# EAGLE design 8x8x8_LEDCUBE_Electronics (EAGLE 9.5.1)
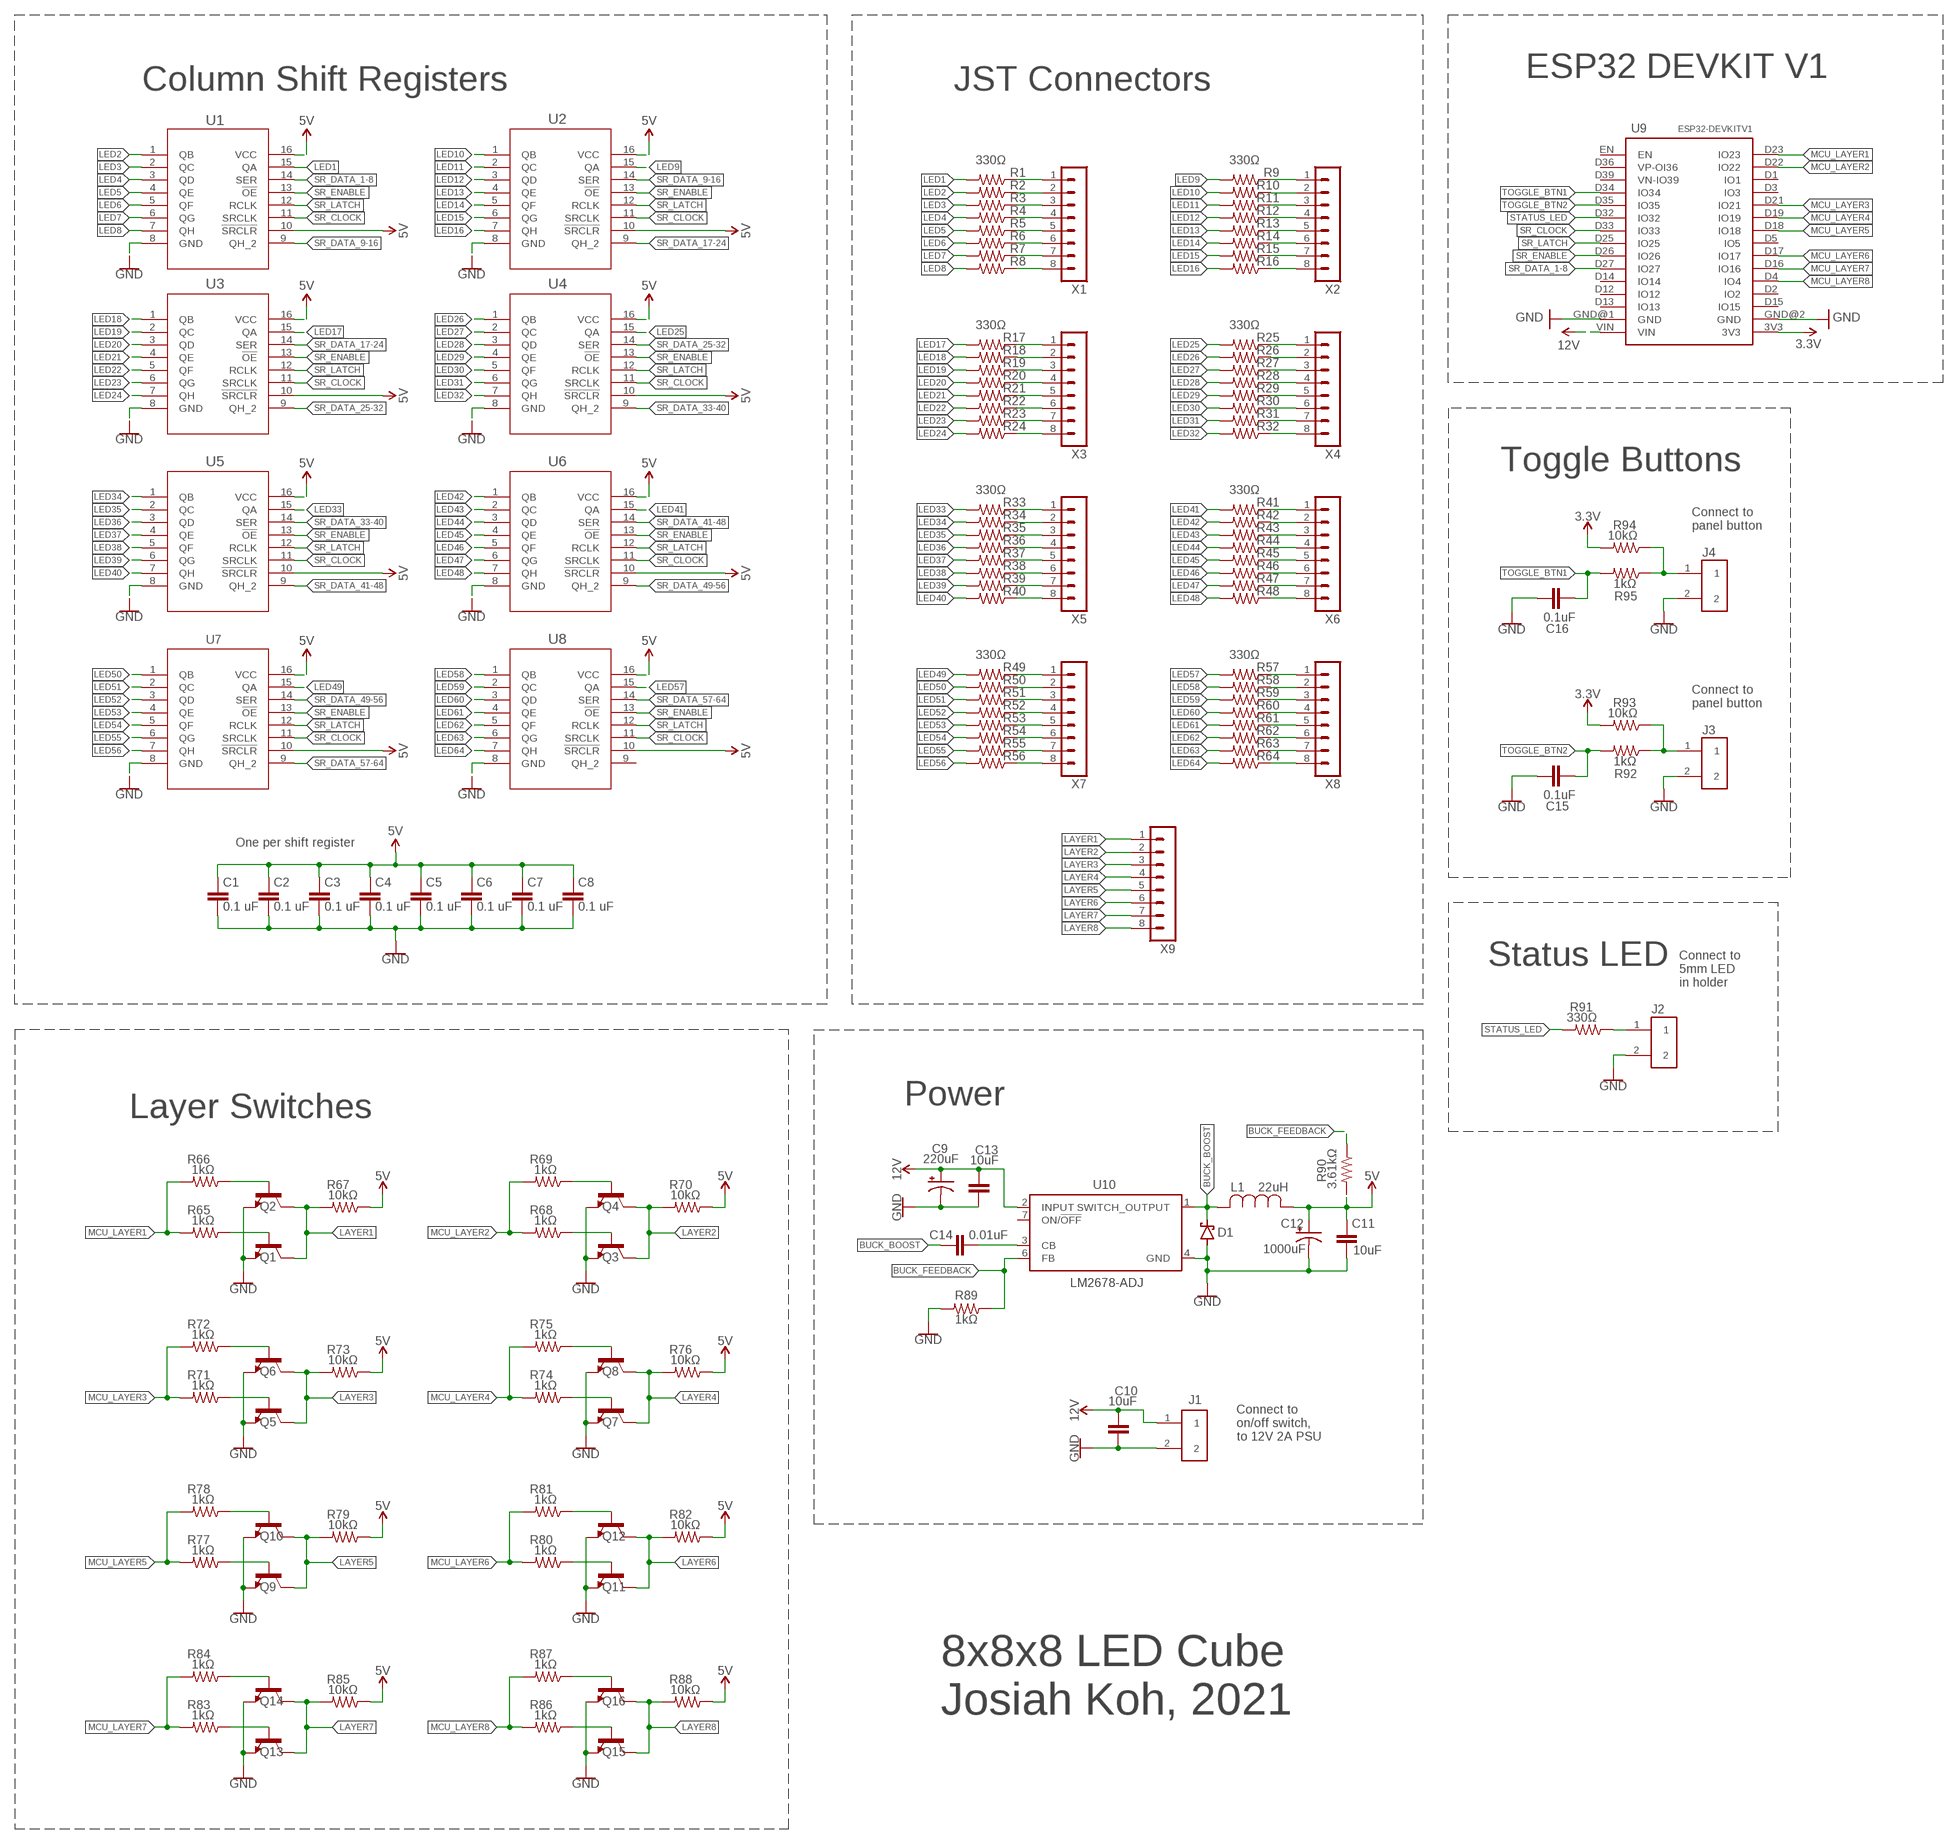
[diagram p0: schematic, sheet 1]

## Parts
C1  0.1 uF  C-EUC0805  [C0805]
C2  0.1 uF  C-EUC0805  [C0805]
C3  0.1 uF  C-EUC0805  [C0805]
C4  0.1 uF  C-EUC0805  [C0805]
C5  0.1 uF  C-EUC0805  [C0805]
C6  0.1 uF  C-EUC0805  [C0805]
C7  0.1 uF  C-EUC0805  [C0805]
C8  0.1 uF  C-EUC0805  [C0805]
C9  220uF  CPOL-USE3.5-10  [E3,5-10]
C10  10uF  C-EUC0805  [C0805]
C11  10uF  C-EUC0805  [C0805]
C12  1000uF  CPOL-USE3.5-10  [E3,5-10]
C13  10uF  C-EUC0805  [C0805]
C14  0.01uF  C-EUC0805  [C0805]
C15  0.1uF  C-EUC0805  [C0805]
C16  0.1uF  C-EUC0805  [C0805]
D1  STPS5L60S  SCHOTTKY-DIODESMC  [SMC]
J1  1935161  [PHOENIX_1935161]
J2  1935161  [PHOENIX_1935161]
J3  1935161  [PHOENIX_1935161]
J4  1935161  [PHOENIX_1935161]
L1  22uH  AIAP-03-220K  [AIAP-03_ABR]
Q1  600mA/40V  TRANS_NPN-P2N2222A  [TO-92]
Q2  600mA/40V  TRANS_NPN-P2N2222A  [TO-92]
Q3  600mA/40V  TRANS_NPN-P2N2222A  [TO-92]
Q4  600mA/40V  TRANS_NPN-P2N2222A  [TO-92]
Q5  600mA/40V  TRANS_NPN-P2N2222A  [TO-92]
Q6  600mA/40V  TRANS_NPN-P2N2222A  [TO-92]
Q7  600mA/40V  TRANS_NPN-P2N2222A  [TO-92]
Q8  600mA/40V  TRANS_NPN-P2N2222A  [TO-92]
Q9  600mA/40V  TRANS_NPN-P2N2222A  [TO-92]
Q10  600mA/40V  TRANS_NPN-P2N2222A  [TO-92]
Q11  600mA/40V  TRANS_NPN-P2N2222A  [TO-92]
Q12  600mA/40V  TRANS_NPN-P2N2222A  [TO-92]
Q13  600mA/40V  TRANS_NPN-P2N2222A  [TO-92]
Q14  600mA/40V  TRANS_NPN-P2N2222A  [TO-92]
Q15  600mA/40V  TRANS_NPN-P2N2222A  [TO-92]
Q16  600mA/40V  TRANS_NPN-P2N2222A  [TO-92]
R1  330Ω  R-US_R0805  [R0805]
R2  330Ω  R-US_R0805  [R0805]
R3  330Ω  R-US_R0805  [R0805]
R4  330Ω  R-US_R0805  [R0805]
R5  330Ω  R-US_R0805  [R0805]
R6  330Ω  R-US_R0805  [R0805]
R7  330Ω  R-US_R0805  [R0805]
R8  330Ω  R-US_R0805  [R0805]
R9  330Ω  R-US_R0805  [R0805]
R10  330Ω  R-US_R0805  [R0805]
R11  330Ω  R-US_R0805  [R0805]
R12  330Ω  R-US_R0805  [R0805]
R13  330Ω  R-US_R0805  [R0805]
R14  330Ω  R-US_R0805  [R0805]
R15  330Ω  R-US_R0805  [R0805]
R16  330Ω  R-US_R0805  [R0805]
R17  330Ω  R-US_R0805  [R0805]
R18  330Ω  R-US_R0805  [R0805]
R19  330Ω  R-US_R0805  [R0805]
R20  330Ω  R-US_R0805  [R0805]
R21  330Ω  R-US_R0805  [R0805]
R22  330Ω  R-US_R0805  [R0805]
R23  330Ω  R-US_R0805  [R0805]
R24  330Ω  R-US_R0805  [R0805]
R25  330Ω  R-US_R0805  [R0805]
R26  330Ω  R-US_R0805  [R0805]
R27  330Ω  R-US_R0805  [R0805]
R28  330Ω  R-US_R0805  [R0805]
R29  330Ω  R-US_R0805  [R0805]
R30  330Ω  R-US_R0805  [R0805]
R31  330Ω  R-US_R0805  [R0805]
R32  330Ω  R-US_R0805  [R0805]
R33  330Ω  R-US_R0805  [R0805]
R34  330Ω  R-US_R0805  [R0805]
R35  330Ω  R-US_R0805  [R0805]
R36  330Ω  R-US_R0805  [R0805]
R37  330Ω  R-US_R0805  [R0805]
R38  330Ω  R-US_R0805  [R0805]
R39  330Ω  R-US_R0805  [R0805]
R40  330Ω  R-US_R0805  [R0805]
R41  330Ω  R-US_R0805  [R0805]
R42  330Ω  R-US_R0805  [R0805]
R43  330Ω  R-US_R0805  [R0805]
R44  330Ω  R-US_R0805  [R0805]
R45  330Ω  R-US_R0805  [R0805]
R46  330Ω  R-US_R0805  [R0805]
R47  330Ω  R-US_R0805  [R0805]
R48  330Ω  R-US_R0805  [R0805]
R49  330Ω  R-US_R0805  [R0805]
R50  330Ω  R-US_R0805  [R0805]
R51  330Ω  R-US_R0805  [R0805]
R52  330Ω  R-US_R0805  [R0805]
R53  330Ω  R-US_R0805  [R0805]
R54  330Ω  R-US_R0805  [R0805]
R55  330Ω  R-US_R0805  [R0805]
R56  330Ω  R-US_R0805  [R0805]
R57  330Ω  R-US_R0805  [R0805]
R58  330Ω  R-US_R0805  [R0805]
R59  330Ω  R-US_R0805  [R0805]
R60  330Ω  R-US_R0805  [R0805]
R61  330Ω  R-US_R0805  [R0805]
R62  330Ω  R-US_R0805  [R0805]
R63  330Ω  R-US_R0805  [R0805]
R64  330Ω  R-US_R0805  [R0805]
R65  1kΩ  R-US_R0805  [R0805]
R66  1kΩ  R-US_R0805  [R0805]
R67  10kΩ  R-US_R0805  [R0805]
R68  1kΩ  R-US_R0805  [R0805]
R69  1kΩ  R-US_R0805  [R0805]
R70  10kΩ  R-US_R0805  [R0805]
R71  1kΩ  R-US_R0805  [R0805]
R72  1kΩ  R-US_R0805  [R0805]
R73  10kΩ  R-US_R0805  [R0805]
R74  1kΩ  R-US_R0805  [R0805]
R75  1kΩ  R-US_R0805  [R0805]
R76  10kΩ  R-US_R0805  [R0805]
R77  1kΩ  R-US_R0805  [R0805]
R78  1kΩ  R-US_R0805  [R0805]
R79  10kΩ  R-US_R0805  [R0805]
R80  1kΩ  R-US_R0805  [R0805]
R81  1kΩ  R-US_R0805  [R0805]
R82  10kΩ  R-US_R0805  [R0805]
R83  1kΩ  R-US_R0805  [R0805]
R84  1kΩ  R-US_R0805  [R0805]
R85  10kΩ  R-US_R0805  [R0805]
R86  1kΩ  R-US_R0805  [R0805]
R87  1kΩ  R-US_R0805  [R0805]
R88  10kΩ  R-US_R0805  [R0805]
R89  1kΩ  R-US_R0805  [R0805]
R90  3.61kΩ  R-US_R0805  [R0805]
R91  330Ω  R-US_R0805  [R0805]
R92  1kΩ  R-US_R0805  [R0805]
R93  10kΩ  R-US_R0805  [R0805]
R94  10kΩ  R-US_R0805  [R0805]
R95  1kΩ  R-US_R0805  [R0805]
U1  SN74HC595N  [N16]
U2  SN74HC595N  [N16]
U3  SN74HC595N  [N16]
U4  SN74HC595N  [N16]
U5  SN74HC595N  [N16]
U6  SN74HC595N  [N16]
U7  SN74HC595N  [N16]
U8  SN74HC595N  [N16]
U9  ESP32DEVKITV1  [ESP32-DEVKITV1]
U10  LM2678-ADJ  LM2678T-ADJ/NOPB  [TO127P1041X469X2199-7N]
X1  B8B-PH-KL  [B8B-PH-K-S]
X2  B8B-PH-KL  [B8B-PH-K-S]
X3  B8B-PH-KL  [B8B-PH-K-S]
X4  B8B-PH-KL  [B8B-PH-K-S]
X5  B8B-PH-KL  [B8B-PH-K-S]
X6  B8B-PH-KL  [B8B-PH-K-S]
X7  B8B-PH-KL  [B8B-PH-K-S]
X8  B8B-PH-KL  [B8B-PH-K-S]
X9  B8B-PH-KL  [B8B-PH-K-S]

## Nets
3.3V [power]: R93.2 R94.2 U9.3V3
5V [power]: C1.1 C2.1 C3.1 C4.1 C5.1 C6.1 C7.1 C8.1 C11.1 C12.+ L1.1 R67.1 R70.1 R73.1 R76.1 R79.1 R82.1 R85.1 R88.1 R90.2 U1.10(!SRCLR) U1.16(VCC) U2.10(!SRCLR) U2.16(VCC) U3.10(!SRCLR) U3.16(VCC) U4.10(!SRCLR) U4.16(VCC) U5.10(!SRCLR) U5.16(VCC) U6.10(!SRCLR) U6.16(VCC) U7.10(!SRCLR) U7.16(VCC) U8.10(!SRCLR) U8.16(VCC)
12V: C9.+ C10.1 C13.1 J1.1 U9.VIN U10.2(INPUT)
BTN1_CONNECTOR: J4.1 R94.1 R95.1
BTN2_CONNECTOR: J3.1 R92.1 R93.1
BUCK_BOOST: C14.1 D1.C L1.2 U10.1(SWITCH_OUTPUT)
BUCK_FEEDBACK [power]: R89.1 R90.1 U10.6(FB)
GND [power]: C1.2 C2.2 C3.2 C4.2 C5.2 C6.2 C7.2 C8.2 C9.- C10.2 C11.2 C12.- C13.2 C15.2 C16.2 D1.A J1.2 J2.2 J3.2 J4.2 Q1.3(E) Q2.3(E) Q3.3(E) Q4.3(E) Q5.3(E) Q6.3(E) Q7.3(E) Q8.3(E) Q9.3(E) Q10.3(E) Q11.3(E) Q12.3(E) Q13.3(E) Q14.3(E) Q15.3(E) Q16.3(E) R89.2 U1.8(GND) U2.8(GND) U3.8(GND) U4.8(GND) U5.8(GND) U6.8(GND) U7.8(GND) U8.8(GND) U9.GND@1(GND) U9.GND@2(GND) U10.4(GND)
LAYER1: Q1.1(C) Q2.1(C) R67.2 X9.1
LAYER2: Q3.1(C) Q4.1(C) R70.2 X9.2
LAYER3: Q5.1(C) Q6.1(C) R73.2 X9.3
LAYER4: Q7.1(C) Q8.1(C) R76.2 X9.4
LAYER5: Q9.1(C) Q10.1(C) R79.2 X9.5
LAYER6: Q11.1(C) Q12.1(C) R82.2 X9.6
LAYER7: Q13.1(C) Q14.1(C) R85.2 X9.7
LAYER8: Q15.1(C) Q16.1(C) R88.2 X9.8
LED1: R1.2 U1.15(QA)
LED2: R2.2 U1.1(QB)
LED3: R3.2 U1.2(QC)
LED4: R4.2 U1.3(QD)
LED5: R5.2 U1.4(QE)
LED6: R6.2 U1.5(QF)
LED7: R7.2 U1.6(QG)
LED8: R8.2 U1.7(QH)
LED9: R9.2 U2.15(QA)
LED10: R10.2 U2.1(QB)
LED11: R11.2 U2.2(QC)
LED12: R12.2 U2.3(QD)
LED13: R13.2 U2.4(QE)
LED14: R14.2 U2.5(QF)
LED15: R15.2 U2.6(QG)
LED16: R16.2 U2.7(QH)
LED17: R17.2 U3.15(QA)
LED18: R18.2 U3.1(QB)
LED19: R19.2 U3.2(QC)
LED20: R20.2 U3.3(QD)
LED21: R21.2 U3.4(QE)
LED22: R22.2 U3.5(QF)
LED23: R23.2 U3.6(QG)
LED24: R24.2 U3.7(QH)
LED25: R25.2 U4.15(QA)
LED26: R26.2 U4.1(QB)
LED27: R27.2 U4.2(QC)
LED28: R28.2 U4.3(QD)
LED29: R29.2 U4.4(QE)
LED30: R30.2 U4.5(QF)
LED31: R31.2 U4.6(QG)
LED32: R32.2 U4.7(QH)
LED33: R33.2 U5.15(QA)
LED34: R34.2 U5.1(QB)
LED35: R35.2 U5.2(QC)
LED36: R36.2 U5.3(QD)
LED37: R37.2 U5.4(QE)
LED38: R38.2 U5.5(QF)
LED39: R39.2 U5.6(QG)
LED40: R40.2 U5.7(QH)
LED41: R41.2 U6.15(QA)
LED42: R42.2 U6.1(QB)
LED43: R43.2 U6.2(QC)
LED44: R44.2 U6.3(QD)
LED45: R45.2 U6.4(QE)
LED46: R46.2 U6.5(QF)
LED47: R47.2 U6.6(QG)
LED48: R48.2 U6.7(QH)
LED49: R49.2 U7.15(QA)
LED50: R50.2 U7.1(QB)
LED51: R51.2 U7.2(QC)
LED52: R52.2 U7.3(QD)
LED53: R53.2 U7.4(QE)
LED54: R54.2 U7.5(QF)
LED55: R55.2 U7.6(QG)
LED56: R56.2 U7.7(QH)
LED57: R57.2 U8.15(QA)
LED58: R58.2 U8.1(QB)
LED59: R59.2 U8.2(QC)
LED60: R60.2 U8.3(QD)
LED61: R61.2 U8.4(QE)
LED62: R62.2 U8.5(QF)
LED63: R63.2 U8.6(QG)
LED64: R64.2 U8.7(QH)
MCU_LAYER1: R65.2 R66.2 U9.D23(IO23)
MCU_LAYER2: R68.2 R69.2 U9.D22(IO22)
MCU_LAYER3: R71.2 R72.2 U9.D21(IO21)
MCU_LAYER4: R74.2 R75.2 U9.D19(IO19)
MCU_LAYER5: R77.2 R78.2 U9.D18(IO18)
MCU_LAYER6: R80.2 R81.2 U9.D17(IO17)
MCU_LAYER7: R83.2 R84.2 U9.D16(IO16)
MCU_LAYER8: R86.2 R87.2 U9.D4(IO4)
N$1: Q1.2(B) R65.1
N$2: Q2.2(B) R66.1
N$3: Q3.2(B) R68.1
N$4: Q4.2(B) R69.1
N$5: Q5.2(B) R71.1
N$6: Q6.2(B) R72.1
N$7: Q7.2(B) R74.1
N$8: Q8.2(B) R75.1
N$9: Q9.2(B) R77.1
N$10: Q10.2(B) R78.1
N$11: Q11.2(B) R80.1
N$12: Q12.2(B) R81.1
N$13: Q13.2(B) R83.1
N$14: Q14.2(B) R84.1
N$15: Q15.2(B) R86.1
N$16: Q16.2(B) R87.1
N$22: J2.1 R91.1
N$24: R1.1 X1.1
N$25: C14.2 U10.3(CB)
N$26: R2.1 X1.2
N$28: R3.1 X1.3
N$29: R4.1 X1.4
N$30: R5.1 X1.5
N$31: R6.1 X1.6
N$32: R7.1 X1.7
N$33: R8.1 X1.8
N$40: R9.1 X2.1
N$41: R10.1 X2.2
N$43: R11.1 X2.3
N$44: R12.1 X2.4
N$45: R13.1 X2.5
N$46: R14.1 X2.6
N$47: R15.1 X2.7
N$48: R16.1 X2.8
N$55: R17.1 X3.1
N$56: R18.1 X3.2
N$58: R19.1 X3.3
N$59: R20.1 X3.4
N$60: R21.1 X3.5
N$61: R22.1 X3.6
N$62: R23.1 X3.7
N$63: R24.1 X3.8
N$70: R25.1 X4.1
N$71: R26.1 X4.2
N$73: R27.1 X4.3
N$74: R28.1 X4.4
N$75: R29.1 X4.5
N$76: R30.1 X4.6
N$77: R31.1 X4.7
N$78: R32.1 X4.8
N$85: R33.1 X5.1
N$86: R34.1 X5.2
N$88: R35.1 X5.3
N$89: R36.1 X5.4
N$90: R37.1 X5.5
N$91: R38.1 X5.6
N$92: R39.1 X5.7
N$93: R40.1 X5.8
N$100: R41.1 X6.1
N$101: R42.1 X6.2
N$103: R43.1 X6.3
N$104: R44.1 X6.4
N$105: R45.1 X6.5
N$106: R46.1 X6.6
N$107: R47.1 X6.7
N$108: R48.1 X6.8
N$115: R49.1 X7.1
N$116: R50.1 X7.2
N$118: R51.1 X7.3
N$119: R52.1 X7.4
N$120: R53.1 X7.5
N$121: R54.1 X7.6
N$122: R55.1 X7.7
N$123: R56.1 X7.8
N$130: R57.1 X8.1
N$131: R58.1 X8.2
N$133: R59.1 X8.3
N$134: R60.1 X8.4
N$135: R61.1 X8.5
N$136: R62.1 X8.6
N$137: R63.1 X8.7
N$138: R64.1 X8.8
SR_CLOCK: U1.11(SRCLK) U2.11(SRCLK) U3.11(SRCLK) U4.11(SRCLK) U5.11(SRCLK) U6.11(SRCLK) U7.11(SRCLK) U8.11(SRCLK) U9.D33(IO33)
SR_DATA_1-8: U1.14(SER) U9.D27(IO27)
SR_DATA_9-16: U1.9(QH_2) U2.14(SER)
SR_DATA_17-24: U2.9(QH_2) U3.14(SER)
SR_DATA_25-32: U3.9(QH_2) U4.14(SER)
SR_DATA_33-40: U4.9(QH_2) U5.14(SER)
SR_DATA_41-48: U5.9(QH_2) U6.14(SER)
SR_DATA_49-56: U6.9(QH_2) U7.14(SER)
SR_DATA_57-64: U7.9(QH_2) U8.14(SER)
SR_ENABLE: U1.13(!OE) U2.13(!OE) U3.13(!OE) U4.13(!OE) U5.13(!OE) U6.13(!OE) U7.13(!OE) U8.13(!OE) U9.D26(IO26)
SR_LATCH: U1.12(RCLK) U2.12(RCLK) U3.12(RCLK) U4.12(RCLK) U5.12(RCLK) U6.12(RCLK) U7.12(RCLK) U8.12(RCLK) U9.D25(IO25)
STATUS_LED: R91.2 U9.D32(IO32)
TOGGLE_BTN1: C16.1 R95.2 U9.D34(IO34)
TOGGLE_BTN2: C15.1 R92.2 U9.D35(IO35)
Unconnected: U8.9(QH_2) U9.D1(IO1) U9.D2(IO2) U9.D3(IO3) U9.D5(IO5) U9.D12(IO12) U9.D13(IO13) U9.D14(IO14) U9.D15(IO15) U9.D36(VP-OI36) U9.D39(VN-IO39) U9.EN U10.7(ON/!OFF)

## Notes on the sheet
- ESP32 DEVKIT V1
- Column Shift Registers | JST Connectors
- Toggle Buttons
- Connect to
  panel button
- Connect to
  panel button
- One per shift register
- Status LED
- Connect to
  5mm LED
  in holder
- Power
- Layer Switches
- Connect to
  on/off switch,
  to 12V 2A PSU
- 8x8x8 LED Cube
  Josiah Koh, 2021

## Library data of the parts
C1-C8 C10 C11 C13-C16 = rcl:C-EU: CAPACITOR, European symbol; SPICEPREFIX: C
C9 C12 = rcl:CPOL-US: POLARIZED CAPACITOR, American symbol; SPICEPREFIX: C
D1 = diode:SCHOTTKY-DIODE: Schottky Diode
J1-J4 = LED_Cube_v5:1935161: Conn Terminal Blocks 2 POS 5mm Solder ST Thru-Hole 16A; DESCRIPTION: 2 Position Wire to Board Terminal Block Horizontal with Board 0.197 _5.00mm_ Through Hole; DIGI-KEY_PART_NUMBER: 277-1667-ND; DIGI-KEY_PURCHASE_URL: https://www.digikey.com/product-detail/en/phoenix-contact/1935161/277-1667-ND/568614?utm_source=snapeda&utm_medium=aggregator&utm_campaign=symbol; MF: Phoenix Contact; MP: 1935161; PACKAGE: None
L1 = LED_Cube_v5:AIAP-03-220K: 22uH inductor; BUILT_BY: EMA_UL_Team; MANUFACTURER_PART_NUMBER: AIAP-03-220K; SOURCELIBRARY: Abracon_2013_02_05_AIAP_Series; VENDOR: Abracon
Q1-Q16 = SparkFun-DiscreteSemi:TRANS_NPN: NPN transistor Current controlled devices typically used to amplify current or used as a switch. BC547 - COM-08928 <http://www.sparkfun.com/products/8928> (TO-92 45V 100mA) (1.Collector 2.Base 3.Emitter) 2N3904 - COM-00521 <http://www.sparkfun.com/products/521> (TO-92 40V 200mA) (1.Emitter 2.Base 3.Collector) P2N2222A - COM-12852 <http://www.sparkfun.com/products/12852> (TO-92 40V 600mA) (1.Collector 2.Base 3.Emitter); PROD_ID: TRANS-09536
R1-R95 = rcl:R-US_: RESISTOR, American symbol; SPICEPREFIX: R
U1-U8 = LED_Cube_v5:SN74HC595N; DATASHEET_URL: http://www.ti.com/lit/gpn/SN74HC595; DESCRIPTION: 8-Bit Shift Registers With 3-State Output Registers; FAMILY_NAME: SHIFT REGISTER; GENERIC_PART_NUMBER: SN74HC595; INDUSTRY_STD_PKG_TYPE: PDIP; MANUFACTURER: Texas Instruments; PACKAGE_DESIGNATOR: N; PIN_COUNT: 16
U9 = LED_Cube_v5:ESP32DEVKITV1: ESP32 DEVKIT V1
U10 = LED_Cube_v5:LM2678T-ADJ/NOPB: SIMPLE SWITCHER High Efficiency 5A Step-Down Voltage Regulator 7-TO-220 -40 to 125; DESCRIPTION: 8V to 40V, 5A SIMPLE SWITCHER buck converter with high efficiency 7-TO-220 -40 to 125; DIGI-KEY_PART_NUMBER: LM2678T-ADJ/NOPB-ND; MF: Texas Instruments; MP: LM2678T-ADJ/NOPB; PACKAGE: TO-220-7 Texas Instruments; PURCHASE-URL: https://pricing.snapeda.com/search/part/LM2678T-ADJ/NOPB/?ref=eda; SPICEPREFIX: X
X1-X9 = LED_Cube_v5:B8B-PH: JST PH series header 2.00mm pitch disconnectable crimp style connectors, vertical (side entry type), 8 pins

## Net classes
0 default: width 0.203 mm, drill 0.508 mm, clearance 0.178 mm
1 power: width 0.305 mm, drill 0.508 mm, clearance 0.178 mm
2 RF: width 0.203 mm, clearance 0.178 mm

## Board
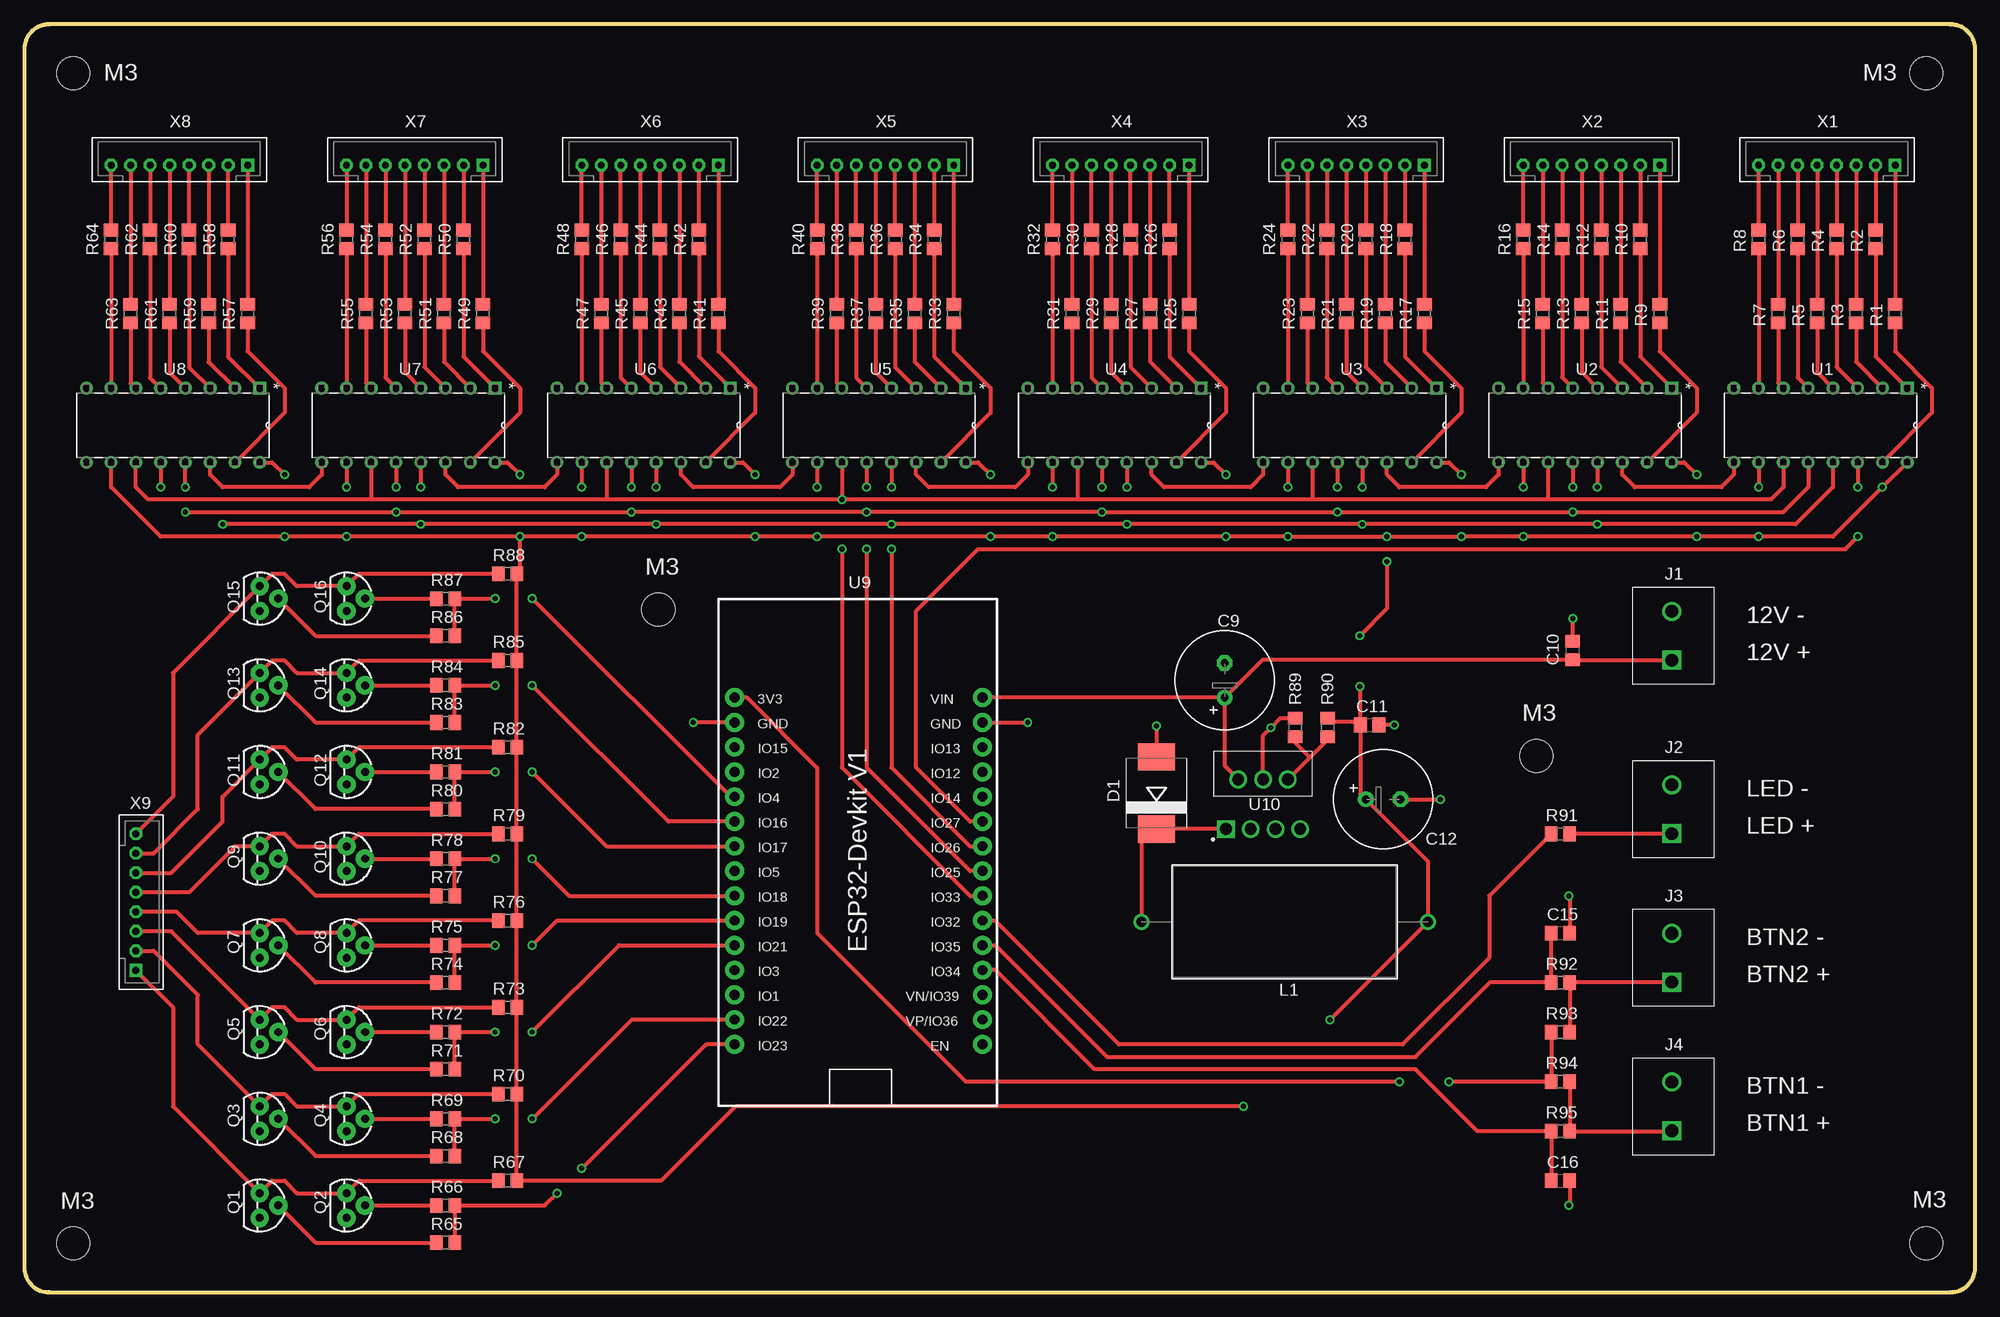
[diagram p1: board, top side]
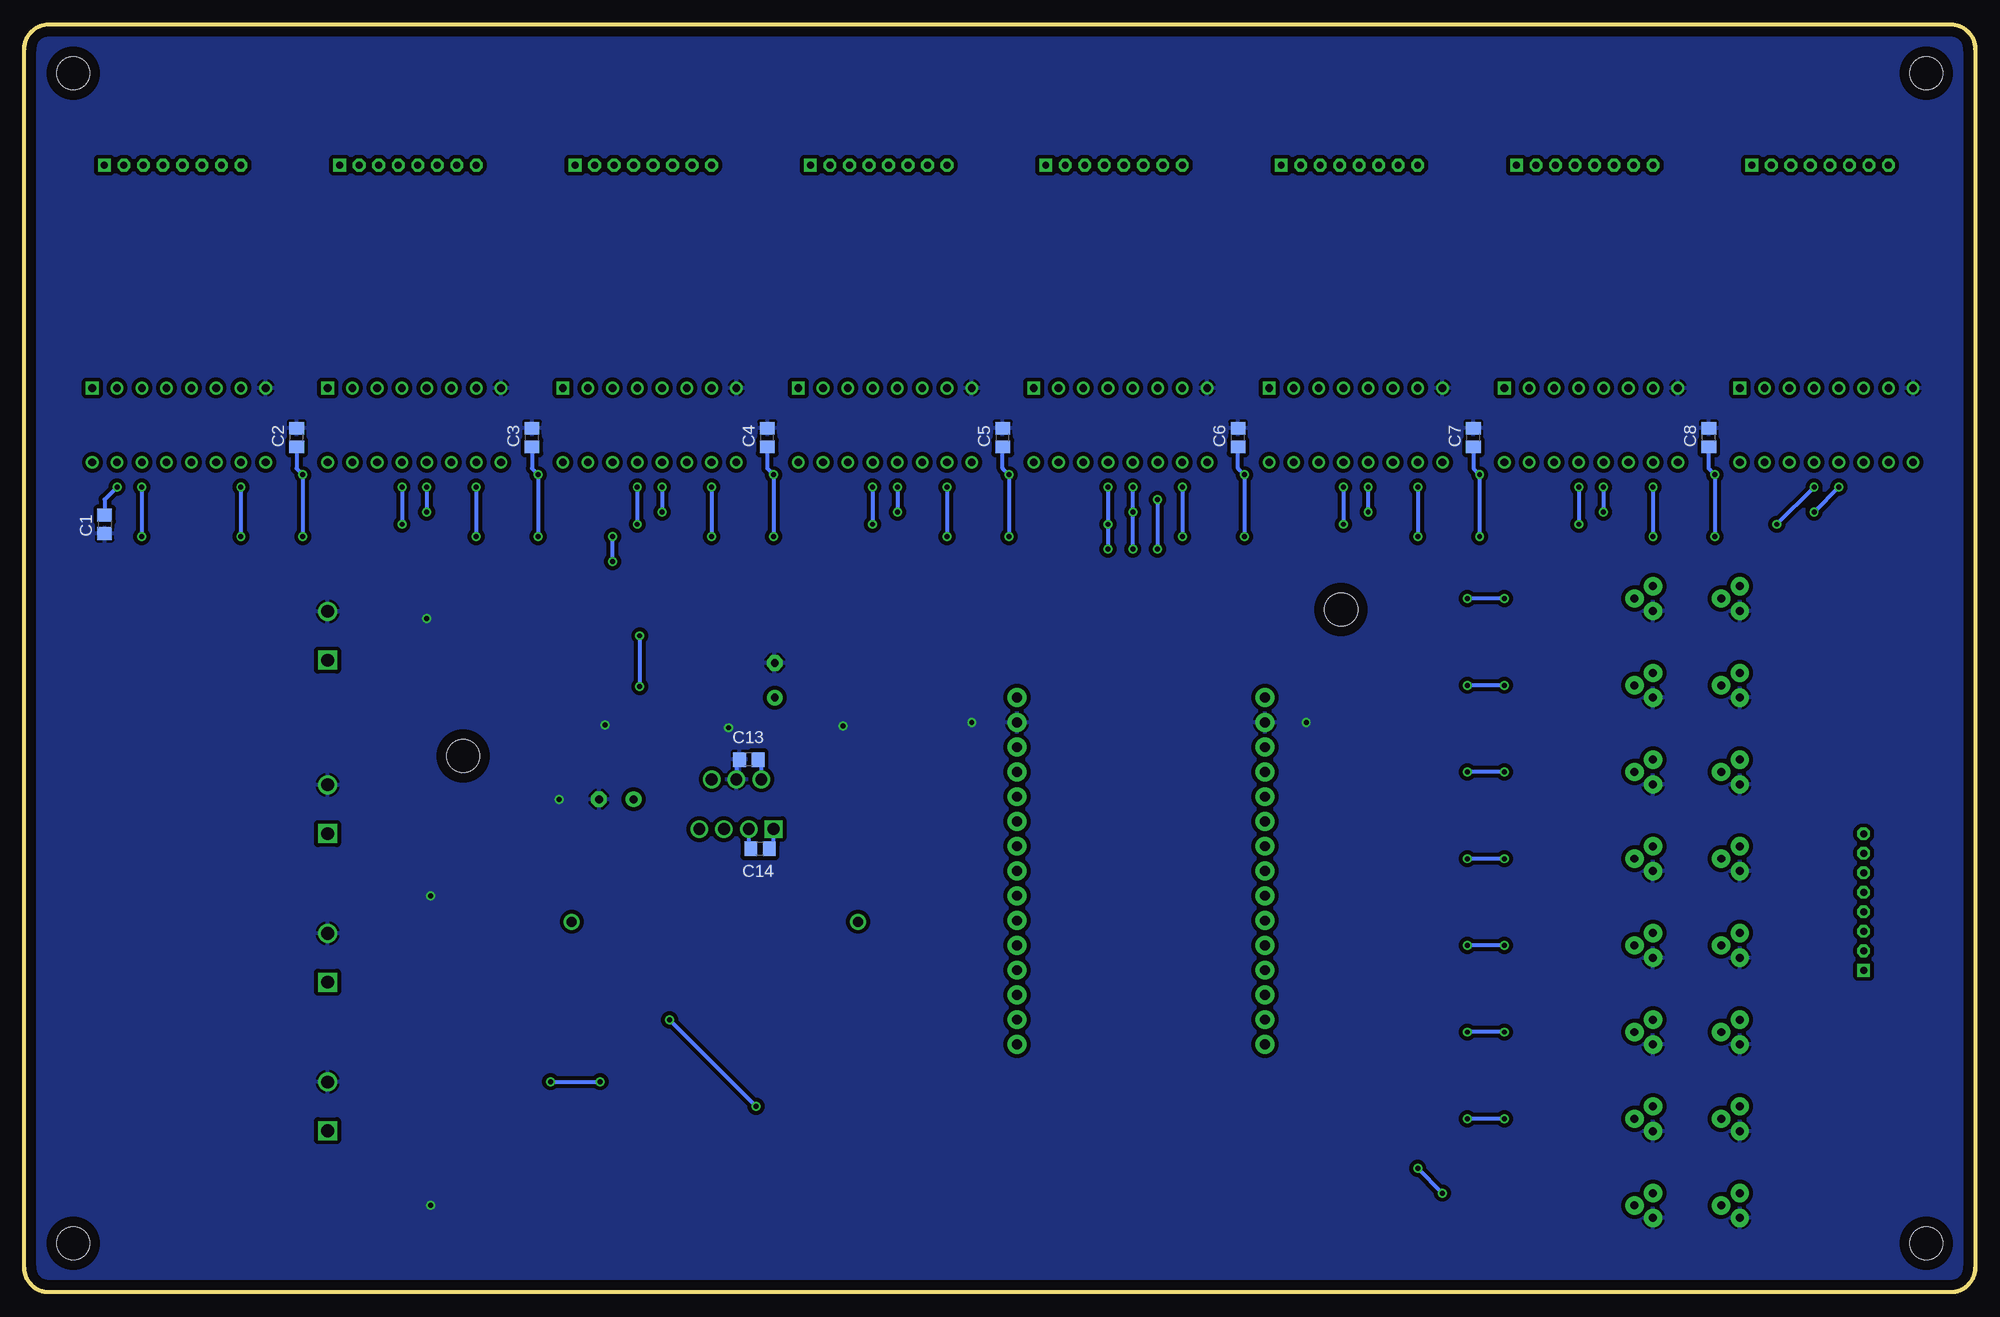
[diagram p2: board, bottom side, seen from below]

Size 200 x 130 mm. Coordinates in mm from the lower left corner, seen from the top.
Outline: 0,127.5 0,2.5 arc90 2.5,0 197.5,0 arc90 200,2.5 200,127.5 arc90 197.5,130 2.5,130 arc90 0,127.5
Copper layers (1*16): Top 0.035mm / dielectric 1.5mm / Bottom 0.035mm
Design rules "default": minimum track width 6mil, minimum drill 0.35mm, track to track 6mil, track to pad 6mil, pad to pad 6mil, via to via 6mil, smd to smd 6mil, copper to edge 40mil, drill to drill 6mil, minimum pad ring 10mil, minimum via ring 8mil, stop-mask expansion 4mil, vias tented up to drill 0mil, thermal gap 10mil
Holes 3.4 mm at 5,5 195,5 65,70 155,55 195,125 5,125

### Footprints (pad centres in the part's own frame; a part is rotated, then mirrored left to right if it is on the bottom)
C0805 = smd 1.3 x 1.5: 1 -0.95,0; 2 0.95,0
E3,5-10 = drill 0.813 pad 1.6: + -1.778,0 | drill 0.813 pad 1.6 octagon: - 1.778,0
SMC = smd 2.8 x 3.8: A 3.7,0; C -3.7,0
PHOENIX_1935161 = drill 1.3 square: 1 -2.5,0 | drill 1.3: 2 2.5,0
AIAP-03_ABR = drill 1.067 pad 1.575: 1 -13.97,0; 2 15.392,0
TO-92 = drill 0.813 pad 1.88: 1 -1.27,0; 2 0,1.905; 3 1.27,0
R0805 = smd 1.3 x 1.5: 1 -0.95,0; 2 0.95,0
N16 = drill 0.787 pad 1.295 square: 1 -3.81,8.89 | drill 0.787 pad 1.295: 2 -3.81,6.35; 3 -3.81,3.81; 4 -3.81,1.27; 5 -3.81,-1.27; 6 -3.81,-3.81; 7 -3.81,-6.35; 8 -3.81,-8.89; 9 3.81,-8.89; 10 3.81,-6.35; 11 3.81,-3.81; 12 3.81,-1.27; 13 3.81,1.27; 14 3.81,3.81; 15 3.81,6.35; 16 3.81,8.89
ESP32-DEVKITV1 = drill 1 pad 1.93: 3V3 -16.52,-12.27; D1 13.96,-12.27; D2 -8.9,-12.27; D3 11.42,-12.27; D4 -6.36,-12.27; D5 1.26,-12.27; D12 -8.9,13.135; D13 -11.44,13.135; D14 -6.36,13.135; D15 -11.44,-12.27; D16 -3.82,-12.27; D17 -1.28,-12.27; D18 3.8,-12.27; D19 6.34,-12.27; D21 8.88,-12.27; D22 16.5,-12.27; D23 19.04,-12.27; D25 1.26,13.135; D26 -1.28,13.135; D27 -3.82,13.135; D32 6.34,13.135; D33 3.8,13.135; D34 11.42,13.135; D35 8.88,13.135; D36 16.5,13.135; D39 13.96,13.135; EN 19.04,13.135; GND@1 -13.98,13.135; GND@2 -13.98,-12.27; VIN -16.52,13.135
TO127P1041X469X2199-7N = drill 1.2 square: 1 -3.81,-5.08 | drill 1.2: 2 -2.54,0; 3 -1.27,-5.08; 4 0,0; 5 1.27,-5.08; 6 2.54,0; 7 3.81,-5.08
B8B-PH-K-S = drill 0.7 pad 1.3 square: 1 7,0 | drill 0.7 pad 1.3 octagon: 2 5,0; 3 3,0; 4 1,0; 5 -1,0; 6 -3,0; 7 -5,0; 8 -7,0

### Placement (x,y rotation side)
C1  191.77,78.74 270 bottom
C2  172.09,87.63 90 bottom
C3  147.96,87.63 90 bottom
C4  123.83,87.63 90 bottom
C5  99.69,87.63 90 bottom
C6  75.56,87.63 90 bottom
C7  51.44,87.63 90 bottom
C8  27.3,87.63 90 bottom
C9  123.06,62.74 90 top
C10  158.75,65.79 90 top
C11  137.92,58.17 0 top
C12  139.32,50.55 0 top
C13  125.73,54.61 180 bottom
C14  124.59,45.47 180 bottom
C15  157.48,36.83 0 top
C16  157.48,11.43 0 top
D1  116.08,51.18 90 top
J1  168.91,67.31 90 top
J2  168.91,49.53 90 top
J3  168.91,34.29 90 top
J4  168.91,19.05 90 top
L1  129.92,37.97 180 top
Q1  24.13,8.89 270 top
Q2  33.02,8.89 270 top
Q3  24.13,17.78 270 top
Q4  33.02,17.78 270 top
Q5  24.13,26.67 270 top
Q6  33.02,26.67 270 top
Q7  24.13,35.56 270 top
Q8  33.02,35.56 270 top
Q9  24.13,44.45 270 top
Q10  33.02,44.45 270 top
Q11  24.13,53.34 270 top
Q12  33.02,53.34 270 top
Q13  24.13,62.23 270 top
Q14  33.02,62.23 270 top
Q15  24.13,71.12 270 top
Q16  33.02,71.12 270 top
R1  191.8,100.33 270 top
R2  189.8,107.95 270 top
R3  187.8,100.33 270 top
R4  185.8,107.95 270 top
R5  183.8,100.33 270 top
R6  181.8,107.95 270 top
R7  179.8,100.33 270 top
R8  177.8,107.95 270 top
R9  167.67,100.33 270 top
R10  165.67,107.95 270 top
R11  163.67,100.33 270 top
R12  161.67,107.95 270 top
R13  159.67,100.33 270 top
R14  157.67,107.95 270 top
R15  155.67,100.33 270 top
R16  153.67,107.95 270 top
R17  143.54,100.33 270 top
R18  141.54,107.95 270 top
R19  139.54,100.33 270 top
R20  137.54,107.95 270 top
R21  135.54,100.33 270 top
R22  133.54,107.95 270 top
R23  131.54,100.33 270 top
R24  129.54,107.95 270 top
R25  119.41,100.33 270 top
R26  117.41,107.95 270 top
R27  115.41,100.33 270 top
R28  113.41,107.95 270 top
R29  111.41,100.33 270 top
R30  109.41,107.95 270 top
R31  107.41,100.33 270 top
R32  105.41,107.95 270 top
R33  95.28,100.33 270 top
R34  93.28,107.95 270 top
R35  91.28,100.33 270 top
R36  89.28,107.95 270 top
R37  87.28,100.33 270 top
R38  85.28,107.95 270 top
R39  83.28,100.33 270 top
R40  81.28,107.95 270 top
R41  71.15,100.33 270 top
R42  69.15,107.95 270 top
R43  67.15,100.33 270 top
R44  65.15,107.95 270 top
R45  63.15,100.33 270 top
R46  61.15,107.95 270 top
R47  59.15,100.33 270 top
R48  57.15,107.95 270 top
R49  47.02,100.33 270 top
R50  45.02,107.95 270 top
R51  43.02,100.33 270 top
R52  41.02,107.95 270 top
R53  39.02,100.33 270 top
R54  37.02,107.95 270 top
R55  35.02,100.33 270 top
R56  33.02,107.95 270 top
R57  22.89,100.33 270 top
R58  20.89,107.95 270 top
R59  18.89,100.33 270 top
R60  16.89,107.95 270 top
R61  14.89,100.33 270 top
R62  12.89,107.95 270 top
R63  10.89,100.33 270 top
R64  8.89,107.95 270 top
R65  43.18,5.08 0 top
R66  43.18,8.89 0 top
R67  49.53,11.43 180 top
R68  43.18,13.97 0 top
R69  43.18,17.78 0 top
R70  49.53,20.32 180 top
R71  43.18,22.86 0 top
R72  43.18,26.67 0 top
R73  49.53,29.21 180 top
R74  43.18,31.75 0 top
R75  43.18,35.56 0 top
R76  49.53,38.1 180 top
R77  43.18,40.64 0 top
R78  43.18,44.45 0 top
R79  49.53,46.99 180 top
R80  43.18,49.53 0 top
R81  43.18,53.34 0 top
R82  49.53,55.88 180 top
R83  43.18,58.42 0 top
R84  43.18,62.23 0 top
R85  49.53,64.77 180 top
R86  43.18,67.31 0 top
R87  43.18,71.12 0 top
R88  49.53,73.66 180 top
R89  130.3,57.91 90 top
R90  133.6,57.91 90 top
R91  157.48,46.99 180 top
R92  157.48,31.75 180 top
R93  157.48,26.67 180 top
R94  157.48,21.59 180 top
R95  157.48,16.51 180 top
U1  184.15,88.9 270 top
U2  160.02,88.9 270 top
U3  135.89,88.9 270 top
U4  111.76,88.9 270 top
U5  87.63,88.9 270 top
U6  63.5,88.9 270 top
U7  39.37,88.9 270 top
U8  15.24,88.9 270 top
U9  85.09,44.45 270 top
U10  127,52.58 0 top
X1  184.8,115.57 0 top
X2  160.67,115.57 0 top
X3  136.54,115.57 0 top
X4  112.41,115.57 0 top
X5  88.28,115.57 0 top
X6  64.15,115.57 0 top
X7  40.02,115.57 0 top
X8  15.89,115.57 0 top
X9  11.43,40.01 270 top

### Tracks (layer width: path | path; a pad name or v marks a point on that pad's centre or on a via)
3.3V  (via drill 0.51)
  Top 0.406: R93.2 R94.2 v146.05,21.59 | U9.3V3 74.09,60.97 81.28,53.78 81.28,36.83 96.52,21.59 v140.97,21.59
  Bottom 0.406: v146.05,21.59 v140.97,21.59
5V  (via drill 0.51)
  Top 0.406: U8.10 8.89,82.55 13.97,77.47 v26.67,77.47 v33.02,77.47 v50.8,77.47 | U1.16 v190.5,82.55 185.42,77.47 v177.8,77.47 v171.45,77.47 v153.67,77.47 v147.32,77.47 v139.7,77.47 v129.54,77.47 v123.19,77.47 v105.41,77.47 v99.06,77.47 v81.28,77.47 v74.93,77.47 v57.15,77.47 v50.8,77.47 | U7.10 v33.02,82.55 | U6.10 v57.15,82.55 | U5.10 v81.28,82.55 | U4.10 v105.41,82.55 | U3.10 v129.54,82.55 | U2.10 v153.67,82.55 | U1.10 v177.8,82.55 | U8.16 25.4,85.09 v26.67,83.82 | U2.16 170.18,85.09 v171.45,83.82 | U3.16 146.05,85.09 v147.32,83.82 | U4.16 121.92,85.09 v123.19,83.82 | U5.16 97.79,85.09 v99.06,83.82 | U6.16 73.66,85.09 v74.93,83.82 | U7.16 49.53,85.09 v50.8,83.82 | v50.8,77.47 50.8,73.98 R88.1 R85.1 R82.1 R79.1 R76.1 R73.1 R70.1 R67.1 65.28,11.43 72.9,19.05 v124.97,19.05 | R90.2 133.99,58.48 136.66,58.48 C11.1 | C11.1 136.97,51.12 C12.+ 143.89,44.2 L1.1 v133.86,27.94 | C11.1 136.91,58.23 v136.91,62.1 | v139.7,74.93 139.7,70.1 v136.91,67.31
  Bottom 0.406: v33.02,82.55 v33.02,77.47 | v57.15,82.55 v57.15,77.47 | v81.28,82.55 v81.28,77.47 | v105.41,82.55 v105.41,77.47 | v129.54,82.55 v129.54,77.47 | v153.67,82.55 v153.67,77.47 | v177.8,82.55 v177.8,77.47 | v26.67,77.47 v26.67,83.82 27.3,84.45 C8.1 | v171.45,77.47 v171.45,83.82 172.09,84.45 C2.1 | v147.32,77.47 v147.32,83.82 147.96,84.45 C3.1 | v123.19,77.47 v123.19,83.82 123.83,84.45 C4.1 | v99.06,77.47 v99.06,83.82 99.69,84.45 C5.1 | v74.93,77.47 v74.93,83.82 75.56,84.45 C6.1 | v50.8,77.47 v50.8,83.82 51.44,84.45 C7.1 | v190.5,82.55 191.77,81.28 C1.1 | v139.7,74.93 v139.7,77.47 | v133.86,27.94 v124.97,19.05 | v136.91,67.31 v136.91,62.1
12V
  Top 0.406: U10.2 123.06,53.98 C9.+ | J1.1 168.88,64.84 C10.1 126.94,64.84 C9.+ | C9.+ U9.VIN
  Bottom 0.406: C13.1 124.78,54.55 124.46,54.23 U10.2
BTN1_CONNECTOR
  Top 0.406: J4.1 168.87,16.51 R95.1 R94.1
BTN2_CONNECTOR
  Top 0.406: J3.1 168.87,31.75 R92.1 R93.1
BUCK_BOOST
  Top 0.406: U10.1 116.09,47.5 D1.C 115.78,47.48 114.53,46.23 L1.2
  Bottom 0.406: C14.1 123.19,45.91 U10.1
BUCK_FEEDBACK
  Top 0.406: U10.6 131.8,54.83 | R89.1 130.3,56.33 131.8,54.83 | 131.8,54.83 133.6,56.64 R90.1
GND  (via drill 0.51)
  Top 0.406: U9.GND@2 v68.58,58.42 | U9.GND@1 v102.86,58.43 v102.87,58.42 | v158.37,40.64 158.43,40.58 C15.2 | C16.2 158.43,8.95 v158.37,8.89 | v140.46,58.17 C11.2 | U10.4 127,57.08 v127.8,57.88 128.78,58.86 R89.2 | C12.- v145.16,50.55 | v116.08,58.04 D1.A | C10.2 v158.75,69.09
  Bottom 0.406: C13.2 126.75,54.61 127,54.36 U10.4
  pour Bottom (isolate 0.406): -2.54,132.68 203.2,132.68 203.2,-3.81 -2.54,-3.81
LAYER1
  Top 0.406: X9.1 15.24,29.2 15.24,19.05 Q1.1 25.4,11.43 26.67,11.43 27.94,10.16 Q2.1 34.29,11.43 R67.2
LAYER2
  Top 0.406: X9.2 13.26,35.01 17.78,30.48 17.78,25.4 Q3.1 25.4,20.32 26.67,20.32 27.94,19.05 Q4.1 34.29,20.32 R70.2
LAYER3
  Top 0.406: X9.3 15.06,37.01 Q5.1 25.4,29.21 26.67,29.21 27.94,27.94 Q6.1 34.29,29.21 R73.2
LAYER4
  Top 0.406: X9.4 15.61,39.01 17.78,36.83 Q7.1 25.4,38.1 26.67,38.1 27.94,36.83 Q8.1 34.29,38.1 R76.2
LAYER5
  Top 0.406: X9.5 16.88,41.01 21.59,45.72 Q9.1 25.4,46.99 26.67,46.99 27.94,45.72 Q10.1 34.29,46.99 R79.2
LAYER6
  Top 0.406: X9.6 15.06,43.01 20.32,48.26 20.32,50.8 Q11.1 25.4,55.88 26.67,55.88 27.94,54.61 Q12.1 34.29,55.88 R82.2
LAYER7
  Top 0.406: X9.7 13.26,45.01 17.78,49.53 17.78,57.15 Q13.1 25.4,64.77 26.67,64.77 27.94,63.5 Q14.1 34.29,64.77 R85.2
LAYER8
  Top 0.406: X9.8 15.24,50.81 15.24,63.5 Q15.1 25.4,73.66 26.67,73.66 27.94,72.39 Q16.1 34.29,73.66 R88.2
LED1
  Top 0.406: R1.2 191.8,96.49 195.58,92.71 195.58,90.17 U1.15
LED2
  Top 0.406: R2.2 189.8,95.95 U1.1
LED3
  Top 0.406: R3.2 187.8,95.41 U1.2
LED4
  Top 0.406: R4.2 185.8,94.87 U1.3
LED5
  Top 0.406: R5.2 183.8,94.33 U1.4
LED6
  Top 0.406: R6.2 181.8,93.79 U1.5
LED7
  Top 0.406: R7.2 179.8,93.25 U1.6
LED8
  Top 0.406: R8.2 U1.7
LED9
  Top 0.406: R9.2 167.67,96.49 171.45,92.71 171.45,90.17 U2.15
LED10
  Top 0.406: R10.2 165.67,95.95 U2.1
LED11
  Top 0.406: R11.2 163.67,95.41 U2.2
LED12
  Top 0.406: R12.2 161.67,94.87 U2.3
LED13
  Top 0.406: R13.2 159.67,94.33 U2.4
LED14
  Top 0.406: R14.2 157.67,93.79 U2.5
LED15
  Top 0.406: R15.2 155.67,93.25 U2.6
LED16
  Top 0.406: R16.2 U2.7
LED17
  Top 0.406: R17.2 143.54,96.49 147.32,92.71 147.32,90.17 U3.15
LED18
  Top 0.406: R18.2 141.54,95.95 U3.1
LED19
  Top 0.406: R19.2 139.54,95.41 U3.2
LED20
  Top 0.406: R20.2 137.54,94.87 U3.3
LED21
  Top 0.406: R21.2 135.54,94.33 U3.4
LED22
  Top 0.406: R22.2 133.54,93.79 U3.5
LED23
  Top 0.406: R23.2 131.54,93.25 U3.6
LED24
  Top 0.406: R24.2 U3.7
LED25
  Top 0.406: R25.2 119.41,96.49 123.19,92.71 123.19,90.17 U4.15
LED26
  Top 0.406: R26.2 117.41,95.95 U4.1
LED27
  Top 0.406: R27.2 115.41,95.41 U4.2
LED28
  Top 0.406: R28.2 113.41,94.87 U4.3
LED29
  Top 0.406: R29.2 111.41,94.33 U4.4
LED30
  Top 0.406: R30.2 109.41,93.79 U4.5
LED31
  Top 0.406: R31.2 107.41,93.25 U4.6
LED32
  Top 0.406: R32.2 U4.7
LED33
  Top 0.406: R33.2 95.28,96.49 99.06,92.71 99.06,90.17 U5.15
LED34
  Top 0.406: R34.2 93.28,95.95 U5.1
LED35
  Top 0.406: R35.2 91.28,95.41 U5.2
LED36
  Top 0.406: R36.2 89.28,94.87 U5.3
LED37
  Top 0.406: R37.2 87.28,94.33 U5.4
LED38
  Top 0.406: R38.2 85.28,93.79 U5.5
LED39
  Top 0.406: R39.2 83.28,93.25 U5.6
LED40
  Top 0.406: R40.2 U5.7
LED41
  Top 0.406: R41.2 71.15,96.49 74.93,92.71 74.93,90.17 U6.15
LED42
  Top 0.406: R42.2 69.15,95.95 U6.1
LED43
  Top 0.406: R43.2 67.15,95.41 U6.2
LED44
  Top 0.406: R44.2 65.15,94.87 U6.3
LED45
  Top 0.406: R45.2 63.15,94.33 U6.4
LED46
  Top 0.406: R46.2 61.15,93.79 U6.5
LED47
  Top 0.406: R47.2 59.15,93.25 U6.6
LED48
  Top 0.406: R48.2 U6.7
LED49
  Top 0.406: R49.2 47.02,96.49 50.8,92.71 50.8,90.17 U7.15
LED50
  Top 0.406: R50.2 45.02,95.95 U7.1
LED51
  Top 0.406: R51.2 43.02,95.41 U7.2
LED52
  Top 0.406: R52.2 41.02,94.87 U7.3
LED53
  Top 0.406: R53.2 39.02,94.33 U7.4
LED54
  Top 0.406: R54.2 37.02,93.79 U7.5
LED55
  Top 0.406: R55.2 35.02,93.25 U7.6
LED56
  Top 0.406: R56.2 U7.7
LED57
  Top 0.406: U8.15 26.67,90.17 26.67,92.71 22.89,96.49 R57.2
LED58
  Top 0.406: R58.2 20.89,95.9 U8.1
LED59
  Top 0.406: R59.2 18.89,95.36 U8.2
LED60
  Top 0.406: R60.2 16.89,94.82 U8.3
LED61
  Top 0.406: R61.2 14.89,94.28 U8.4
LED62
  Top 0.406: R62.2 12.89,93.74 U8.5
LED63
  Top 0.406: R63.2 10.89,93.2 U8.6
LED64
  Top 0.406: R64.2 U8.7
MCU_LAYER1  (via drill 0.51)
  Top 0.406: v54.61,10.16 53.34,8.89 R66.2 R65.2 | U9.D23 69.9,25.41 57.19,12.7 v57.15,12.7
  Bottom 0.406: v54.61,10.16 v57.15,12.7
MCU_LAYER2  (via drill 0.51)
  Top 0.406: R68.2 R69.2 v48.26,17.78 | U9.D22 62.28,27.95 52.11,17.78 v52.07,17.78
  Bottom 0.406: v48.26,17.78 v52.07,17.78
MCU_LAYER3  (via drill 0.51)
  Top 0.406: R71.2 R72.2 v48.26,26.67 | v52.07,26.67 60.97,35.57 U9.D21
  Bottom 0.406: v48.26,26.67 v52.07,26.67
MCU_LAYER4  (via drill 0.51)
  Top 0.406: R74.2 R75.2 v48.26,35.56 | v52.07,35.56 54.62,38.11 U9.D19
  Bottom 0.406: v48.26,35.56 v52.07,35.56
MCU_LAYER5  (via drill 0.51)
  Top 0.406: R77.2 R78.2 v48.26,44.45 | v52.07,44.45 55.87,40.65 U9.D18
  Bottom 0.406: v48.26,44.45 v52.07,44.45
MCU_LAYER6  (via drill 0.51)
  Top 0.406: R80.2 R81.2 v48.26,53.34 | v52.07,53.34 59.68,45.73 U9.D17
  Bottom 0.406: v48.26,53.34 v52.07,53.34
MCU_LAYER7  (via drill 0.51)
  Top 0.406: R83.2 R84.2 v48.26,62.23 | U9.D16 66.03,48.27 v52.07,62.23
  Bottom 0.406: v48.26,62.23 v52.07,62.23
MCU_LAYER8  (via drill 0.51)
  Top 0.406: v52.07,71.12 72.38,50.81 U9.D4 | R86.2 R87.2 v48.26,71.12
  Bottom 0.406: v48.26,71.12 v52.07,71.12
N$1
  Top 0.406: Q1.2 29.84,5.08 R65.1
N$2
  Top 0.406: Q2.2 R66.1
N$3
  Top 0.406: Q3.2 29.84,13.97 R68.1
N$4
  Top 0.406: Q4.2 R69.1
N$5
  Top 0.406: R71.1 29.84,22.86 Q5.2
N$6
  Top 0.406: Q6.2 R72.1
N$7
  Top 0.406: R74.1 29.84,31.75 Q7.2
N$8
  Top 0.406: Q8.2 R75.1
N$9
  Top 0.406: R77.1 29.84,40.64 Q9.2
N$10
  Top 0.406: Q10.2 R78.1
N$11
  Top 0.406: R80.1 29.84,49.53 Q11.2
N$12
  Top 0.406: Q12.2 R81.1
N$13
  Top 0.406: Q13.2 29.84,58.42 R83.1
N$14
  Top 0.406: Q14.2 R84.1
N$15
  Top 0.406: Q15.2 29.84,67.31 R86.1
N$16
  Top 0.406: Q16.2 R87.1
N$22
  Top 0.406: J2.1 168.87,46.99 R91.1
N$24
  Top 0.406: X1.1 R1.1
N$25
  Bottom 0.406: U10.3 125.73,45.66 C14.2
N$26
  Top 0.406: X1.2 R2.1
N$28
  Top 0.406: X1.3 R3.1
N$29
  Top 0.406: X1.4 R4.1
N$30
  Top 0.406: X1.5 R5.1
N$31
  Top 0.406: X1.6 R6.1
N$32
  Top 0.406: X1.7 R7.1
N$33
  Top 0.406: R8.1 X1.8
N$40
  Top 0.406: X2.1 R9.1
N$41
  Top 0.406: X2.2 R10.1
N$43
  Top 0.406: X2.3 R11.1
N$44
  Top 0.406: X2.4 R12.1
N$45
  Top 0.406: X2.5 R13.1
N$46
  Top 0.406: X2.6 R14.1
N$47
  Top 0.406: X2.7 R15.1
N$48
  Top 0.406: R16.1 X2.8
N$55
  Top 0.406: X3.1 R17.1
N$56
  Top 0.406: X3.2 R18.1
N$58
  Top 0.406: X3.3 R19.1
N$59
  Top 0.406: X3.4 R20.1
N$60
  Top 0.406: X3.5 R21.1
N$61
  Top 0.406: X3.6 R22.1
N$62
  Top 0.406: X3.7 R23.1
N$63
  Top 0.406: R24.1 X3.8
N$70
  Top 0.406: X4.1 R25.1
N$71
  Top 0.406: R26.1 X4.2
N$73
  Top 0.406: X4.3 R27.1
N$74
  Top 0.406: R28.1 X4.4
N$75
  Top 0.406: X4.5 R29.1
N$76
  Top 0.406: R30.1 X4.6
N$77
  Top 0.406: X4.7 R31.1
N$78
  Top 0.406: R32.1 X4.8
N$85
  Top 0.406: X5.1 R33.1
N$86
  Top 0.406: X5.2 R34.1
N$88
  Top 0.406: X5.3 R35.1
N$89
  Top 0.406: R36.1 X5.4
N$90
  Top 0.406: X5.5 R37.1
N$91
  Top 0.406: R38.1 X5.6
N$92
  Top 0.406: X5.7 R39.1
N$93
  Top 0.406: R40.1 X5.8
N$100
  Top 0.406: X6.1 R41.1
N$101
  Top 0.406: R42.1 X6.2
N$103
  Top 0.406: X6.3 R43.1
N$104
  Top 0.406: R44.1 X6.4
N$105
  Top 0.406: X6.5 R45.1
N$106
  Top 0.406: R46.1 X6.6
N$107
  Top 0.406: X6.7 R47.1
N$108
  Top 0.406: R48.1 X6.8
N$115
  Top 0.406: X7.1 R49.1
N$116
  Top 0.406: X7.2 R50.1
N$118
  Top 0.406: X7.3 R51.1
N$119
  Top 0.406: X7.4 R52.1
N$120
  Top 0.406: X7.5 R53.1
N$121
  Top 0.406: X7.6 R54.1
N$122
  Top 0.406: X7.7 R55.1
N$123
  Top 0.406: X7.8 R56.1
N$130
  Top 0.406: X8.1 R57.1
N$131
  Top 0.406: R58.1 X8.2
N$133
  Top 0.406: X8.3 R59.1
N$134
  Top 0.406: R60.1 X8.4
N$135
  Top 0.406: X8.5 R61.1
N$136
  Top 0.406: X8.6 R62.1
N$137
  Top 0.406: X8.7 R63.1
N$138
  Top 0.406: R64.1 X8.8
SR_CLOCK  (via drill 0.51)
  Top 0.406: U1.11 180.34,82.55 179.07,81.28 156.21,81.28 | U8.11 11.43,82.55 12.7,81.28 35.56,81.28 | 156.21,81.28 132.08,81.28 | 132.08,81.28 107.95,81.28 | 107.95,81.28 v83.82,81.28 | v83.82,81.28 59.69,81.28 | 59.69,81.28 35.56,81.28 | U7.11 35.56,81.28 | U6.11 59.69,81.28 | U5.11 v83.82,81.28 | U4.11 107.95,81.28 | U3.11 132.08,81.28 | U2.11 156.21,81.28 | v83.82,76.2 83.82,53.78 96.95,40.65 U9.D33
  Bottom 0.406: v83.82,81.28 v83.82,76.2
SR_DATA_1-8  (via drill 0.51)
  Top 0.406: U1.14 v187.96,82.55 | U9.D27 96.95,48.27 91.44,53.78 91.44,69.85 97.79,76.2 186.69,76.2 v187.96,77.47
  Bottom 0.406: v187.96,82.55 v187.96,77.47
SR_DATA_9-16
  Top 0.406: U1.9 175.26,83.82 173.99,82.55 165.1,82.55 163.83,83.82 U2.14
SR_DATA_17-24
  Top 0.406: U2.9 151.13,83.82 149.86,82.55 140.97,82.55 139.7,83.82 U3.14
SR_DATA_25-32
  Top 0.406: U3.9 127,83.82 125.73,82.55 116.84,82.55 115.57,83.82 U4.14
SR_DATA_33-40
  Top 0.406: U4.9 102.87,83.82 101.6,82.55 92.71,82.55 91.44,83.82 U5.14
SR_DATA_41-48
  Top 0.406: U5.9 78.74,83.82 77.47,82.55 68.58,82.55 67.31,83.82 U6.14
SR_DATA_49-56
  Top 0.406: U6.9 54.61,83.82 53.34,82.55 44.45,82.55 43.18,83.82 U7.14
SR_DATA_57-64
  Top 0.406: U7.9 30.48,83.82 29.21,82.55 20.32,82.55 19.05,83.82 U8.14
SR_ENABLE  (via drill 0.51)
  Top 0.406: U1.13 185.42,82.55 181.61,78.74 v161.29,78.74 v137.16,78.74 v113.03,78.74 v88.9,78.74 v64.77,78.74 v40.64,78.74 v20.32,78.74 | v16.51,82.55 U8.13 | U7.13 v40.64,82.55 | U6.13 v64.77,82.55 | U5.13 v88.9,82.55 | U4.13 v113.03,82.55 | U3.13 v137.16,82.55 | U2.13 v161.29,82.55 | U9.D26 96.95,45.73 88.9,53.78 v88.9,76.2
  Bottom 0.406: v20.32,78.74 v16.51,82.55 | v40.64,82.55 v40.64,78.74 | v64.77,82.55 v64.77,78.74 | v88.9,82.55 v88.9,78.74 v88.9,76.2 | v113.03,82.55 v113.03,78.74 | v137.16,82.55 v137.16,78.74 | v161.29,82.55 v161.29,78.74
SR_LATCH  (via drill 0.51)
  Top 0.406: U1.12 182.88,82.55 180.34,80.01 v158.75,80.01 v134.62,80.01 v110.49,80.01 v86.36,80.01 v62.23,80.01 v38.1,80.01 v16.51,80.01 | U8.12 v13.97,82.55 | U7.12 v38.1,82.55 | U6.12 v62.23,82.55 | U5.12 v86.36,82.55 | U4.12 v110.49,82.55 | U3.12 v134.62,82.55 | U2.12 v158.75,82.55 | U9.D25 96.95,43.19 86.36,53.78 v86.36,76.2
  Bottom 0.406: v13.97,82.55 v16.51,80.01 | v38.1,82.55 v38.1,80.01 | v62.23,82.55 v62.23,80.01 | v110.49,82.55 v110.49,80.01 | v134.62,82.55 v134.62,80.01 | v158.75,82.55 v158.75,80.01 | v86.36,76.2 v86.36,80.01 v86.36,82.55
STATUS_LED
  Top 0.406: U9.D32 99.5,38.11 112.2,25.4 141.29,25.4 150.18,34.29 150.18,40.64 R91.2
TOGGLE_BTN1
  Top 0.406: U9.D34 99.56,33.03 109.73,22.86 142.62,22.86 148.97,16.51 R95.2 C16.1
TOGGLE_BTN2
  Top 0.406: C15.1 R92.2 150.24,31.75 142.62,24.13 111,24.13 99.56,35.57 U9.D35

### Text on the board
tNames: M3 | M3 | M3 | 12V - | 12V + | M3 | LED - | LED + | BTN2 - | BTN2 + | BTN1 - | BTN1 + | M3 | M3